# EAGLE design AliDualVar (EAGLE 7.2.0)
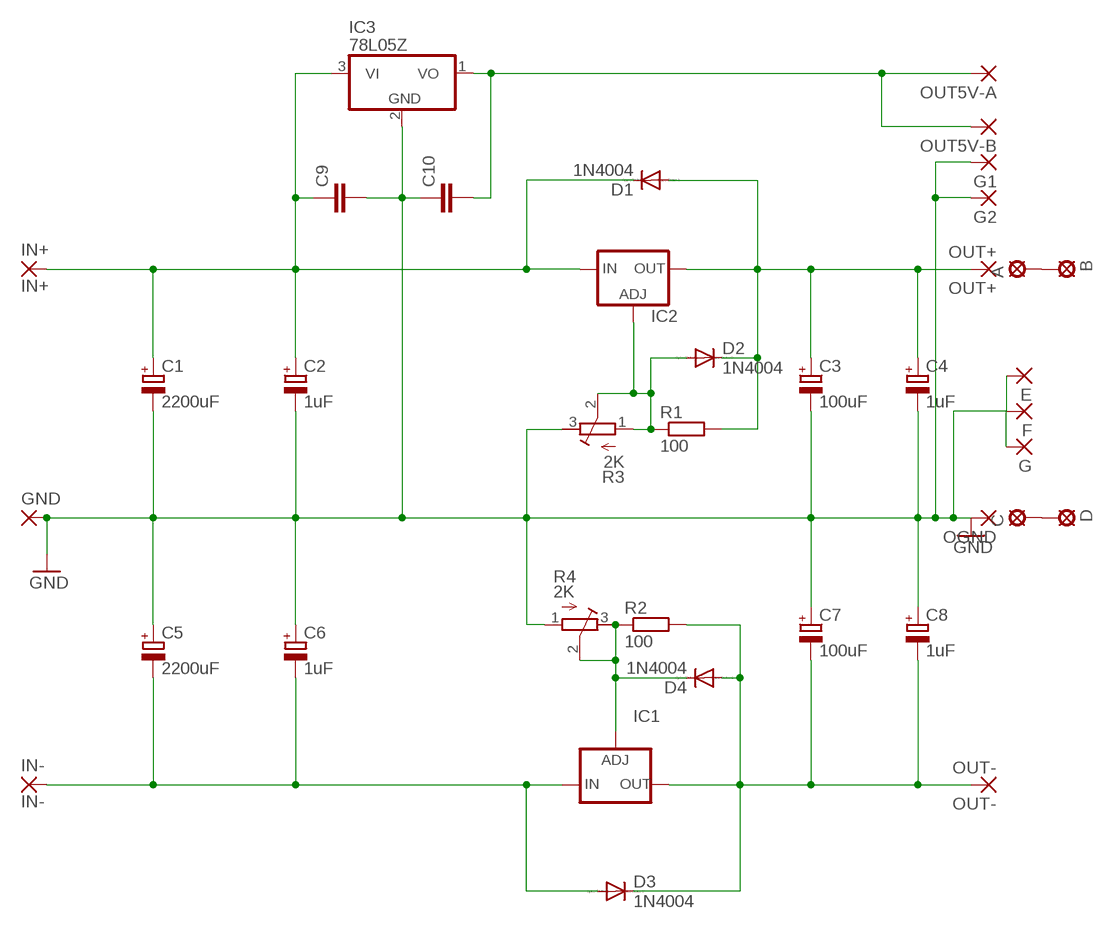
[diagram p0: schematic, sheet 1]

## Parts
A  MCS10B  [MCS10B]
B  MCS10B  [MCS10B]
C  MCS10B  [MCS10B]
C1  2200uF  CPOL-EUE10-35  [EB35D]
C2  1uF  CPOL-EUE5-13  [E5-13]
C3  100uF  CPOL-EUE5-13  [E5-13]
C4  1uF  CPOL-EUE5-13  [E5-13]
C5  2200uF  CPOL-EUE10-35  [EB35D]
C6  1uF  CPOL-EUE5-13  [E5-13]
C7  100uF  CPOL-EUE5-13  [E5-13]
C8  1uF  CPOL-EUE5-13  [E5-13]
C9  C-EU025-024X044  [C025-024X044]
C10  C-EU025-024X044  [C025-024X044]
D  MCS10B  [MCS10B]
D1  1N4004  [DO41-10]
D2  1N4004  [DO41-10]
D3  1N4004  [DO41-10]
D4  1N4004  [DO41-10]
E  3,81/1,4  [3,81/1,4]
F  3,81/1,4  [3,81/1,4]
G  3,81/1,4  [3,81/1,4]
G1  3,81/1,4  [3,81/1,4]
G2  3,81/1,4  [3,81/1,4]
GND  3,81/1,4  [3,81/1,4]
IC1  LM337TL  [337TL]
IC2  LM317TL  [317TL]
IC3  78L05Z  [TO92]
IN+  IN+  3,81/1,4  [3,81/1,4]
IN-  IN-  3,81/1,4  [3,81/1,4]
OGND  3,81/1,4  [3,81/1,4]
OUT5V-A  3,81/1,4  [3,81/1,4]
OUT5V-B  3,81/1,4  [3,81/1,4]
OUT+  OUT+  3,81/1,4  [3,81/1,4]
OUT-  OUT-  3,81/1,4  [3,81/1,4]
R1  100  R-EU_0207/7  [0207/7]
R2  100  R-EU_0207/7  [0207/7]
R3  2K  R-TRIMM3339P  [RTRIM3339P]
R4  2K  R-TRIMM3339P  [RTRIM3339P]

## Nets
GND: C1.- C2.- C3.- C4.- C5.+ C6.+ C7.+ C8.+ C9.2 C10.1 E.1(P) F.1(P) G1.1(P) G2.1(P) G.1(P) GND.1(P) IC3.2(GND) OGND.1(P) R3.3(E) R4.1(A)
N$2: C3.+ C4.+ D1.A D2.C IC2.2(OUT) OUT+.1(P) R1.2
N$3: A.MP B.MP
N$4: C.MP D.MP
N$5: D2.A IC2.1(ADJ) R1.1 R3.1(A) R3.2(S)
N$6: D4.C IC1.1(ADJ) R2.1 R4.2(S) R4.3(E)
N$7: C7.- C8.- D3.C D4.A IC1.3(OUT) OUT-.1(P) R2.2
N$8: C5.- C6.- D3.A IC1.2(IN) IN-.1(P)
N$9: C10.2 IC3.1(VO) OUT5V-A.1(P) OUT5V-B.1(P)
N$12: C1.+ C2.+ C9.1 D1.C IC2.3(IN) IC3.3(VI) IN+.1(P)

## Library data of the parts
A B C D = solpad:MCS10B: SOLDER PAD MC S1, distributor Buerklin, 15F505
C1-C8 = resistor:CPOL-EU: POLARIZED CAPACITOR, European symbol
C9 C10 = rcl:C-EU: CAPACITOR, European symbol
D1-D4 = diode:1N4004: DIODE general purpose rectifier, 1 A
E F G G1 G2 GND IN+ IN- OGND OUT5V-A OUT5V-B OUT+ OUT- = wirepad:3,81/1,4: THROUGH-HOLE PAD
IC1 = v-reg:LM337TL: VOLTAGE REGULATOR
IC2 = v-reg:LM317TL: VOLTAGE REGULATOR
IC3 = linear:78*: Positive VOLTAGE REGULATOR Source: http://cache.national.com/ds/LM/LM78L05.pdf http://www.fairchildsemi.com/ds/LM/LM7805.pdf
R1 R2 = resistor:R-EU_: RESISTOR, European symbol
R3 R4 = resistor:R-TRIMM: Trimm resistor

## Board
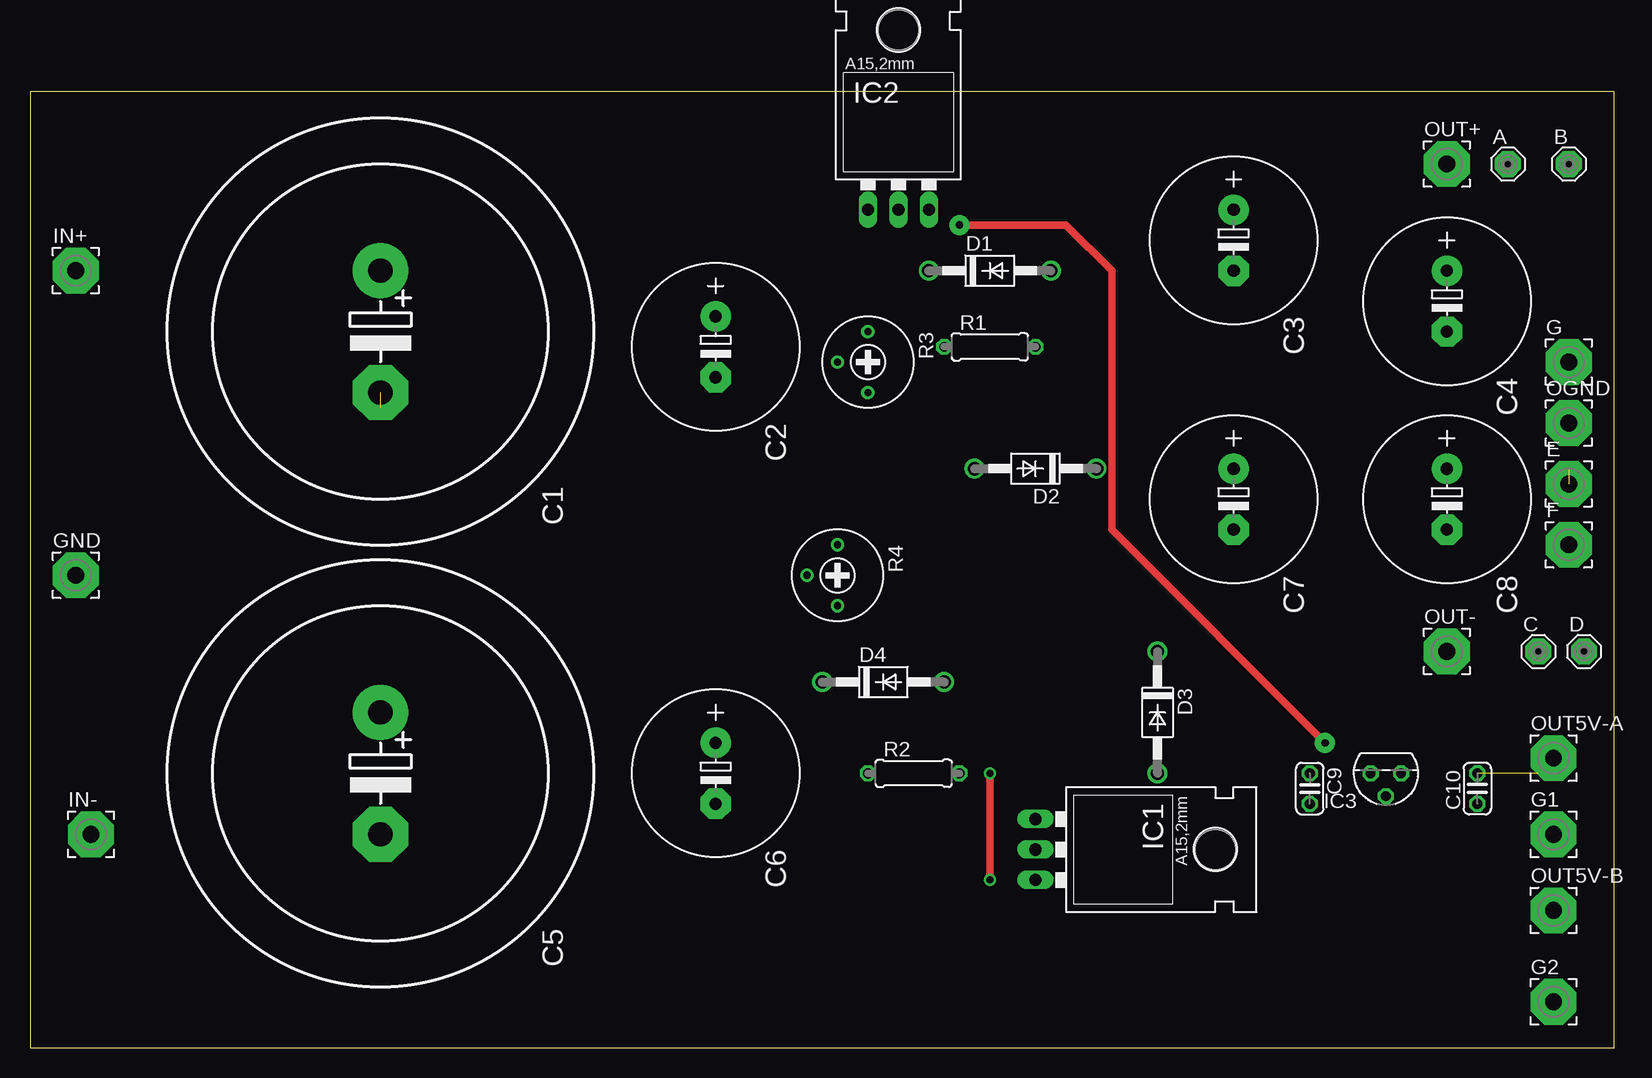
[diagram p1: board, top side]
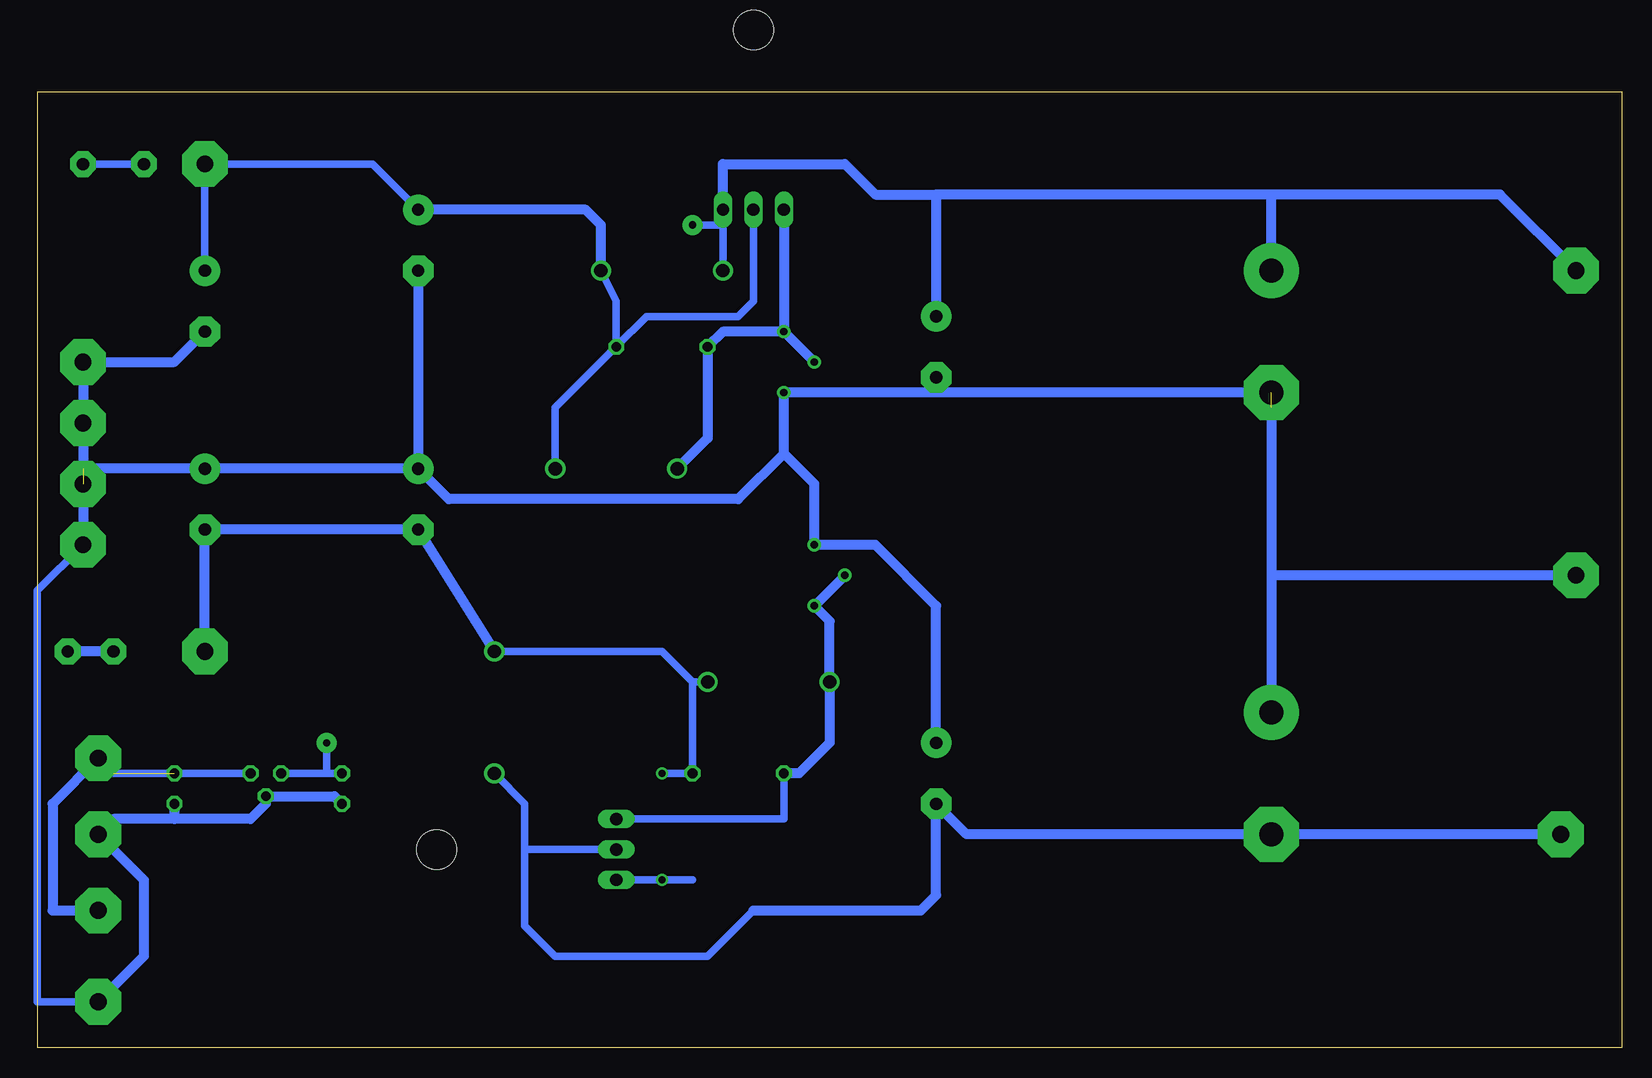
[diagram p2: board, bottom side, seen from below]

Size 132.06 x 79.68 mm. Coordinates in mm from the lower left corner, seen from the top.
Outline: 0,0 132.06,0 132.06,79.68 0,79.68 0,0
Copper layers (1*16): Top 0.035mm / dielectric 1.5mm / Bottom 0.035mm
Design rules "default": minimum track width 10mil, minimum drill 24mil, track to track 8mil, track to pad 8mil, pad to pad 8mil, via to via 8mil, smd to smd 8mil, copper to edge 40mil, drill to drill 8mil, minimum pad ring 10mil, minimum via ring 8mil, stop-mask expansion 4mil, vias tented up to drill 0mil, thermal gap 10mil

### Footprints (pad centres in the part's own frame; a part is rotated, then mirrored left to right if it is on the bottom)
MCS10B = drill 1.016 pad 2.159 octagon: MP 0,0
EB35D = drill 2.007 pad 4.597: + -5.08,0 | drill 2.007 pad 4.597 octagon: - 5.08,0
E5-13 = drill 1.016 pad 2.54: + -2.54,0 | drill 1.016 pad 2.54 octagon: - 2.54,0
C025-024X044 = drill 0.813 octagon: 1 -1.27,0; 2 1.27,0
DO41-10 = drill 1.118: A 5.08,0; C -5.08,0
3,81/1,4 = drill 1.397 pad 3.81 octagon: 1 0,0
337TL = drill 1.016 long: 1 -2.54,-3.81; 2 0,-3.81; 3 2.54,-3.81 | hole 3.302: 0,11.176
317TL = drill 1.016 long: 1 -2.54,-3.81; 2 0,-3.81; 3 2.54,-3.81 | hole 3.302: 0,11.176
TO92 = drill 0.813 octagon: 1 -1.27,0; 2 0,1.905; 3 1.27,0
0207/7 = drill 0.813 octagon: 1 -3.81,0; 2 3.81,0
RTRIM3339P = drill 0.61: 1 -2.54,0; 2 0,-2.54; 3 2.54,0

### Placement (x,y rotation side)
A  123.19,73.66 0 top
B  128.27,73.66 0 top
C  125.73,33.02 0 top
C1  29.21,59.69 270 top
C2  57.15,58.42 270 top
C3  100.33,67.31 270 top
C4  118.11,62.23 270 top
C5  29.21,22.86 270 top
C6  57.15,22.86 270 top
C7  100.33,45.72 270 top
C8  118.11,45.72 270 top
C9  106.68,21.59 270 top
C10  120.65,21.59 90 top
D  129.54,33.02 0 top
D1  80.01,64.77 0 top
D2  83.82,48.26 180 top
D3  93.98,27.94 270 top
D4  71.12,30.48 0 top
E  128.27,46.99 0 top
F  128.27,41.91 0 top
G  128.27,57.15 0 top
G1  127,17.78 0 top
G2  127,3.81 0 top
GND  3.81,39.37 0 top
IC1  87.63,16.51 270 top
IC2  72.39,73.66 0 top
IC3  113.03,22.86 180 top
IN+  3.81,64.77 0 top
IN-  5.08,17.78 0 top
OGND  128.27,52.07 0 top
OUT5V-A  127,24.13 0 top
OUT5V-B  127,11.43 0 top
OUT+  118.11,73.66 0 top
OUT-  118.11,33.02 0 top
R1  80.01,58.42 0 top
R2  73.66,22.86 0 top
R3  69.85,57.15 270 top
R4  67.31,39.37 270 top

### Tracks (layer width: path | path; a pad name or v marks a point on that pad's centre or on a via)
GND  (2 unrouted)
  Bottom 0.61: OGND.1 F.1 132.08,38.1 132.08,3.81 G2.1
  Bottom 0.813: C1.- 29.21,39.37 | 29.21,39.37 C5.+ | GND.1 29.21,39.37 | C6.+ 57.15,36.83 62.23,41.91 R4.1 67.31,46.99 69.85,49.53 | 69.85,49.53 R3.3 57.15,54.61 | 30.48,54.61 57.15,54.61 | C2.- 57.15,54.61 | 69.85,49.53 73.66,45.72 97.79,45.72 C7.+ | C3.- C7.+ | C4.- 120.65,57.15 G.1 OGND.1 128.27,48.26 | 128.27,48.26 F.1 | 128.27,48.26 C8.+ C7.+ | G2.1 123.19,7.62 123.19,13.97 G1.1 125.73,19.05 120.65,19.05 | C9.2 107.31,20.95 IC3.2 113.03,20.32 114.3,19.05 120.65,19.05 | C10.1 120.65,19.05
  Bottom 1.27: 29.21,53.34 27.94,54.61 | C1.- 30.48,54.61
N$2
  Bottom 0.61: IC2.2 72.39,62.23 73.66,60.96 81.28,60.96 R1.2 | D1.A 83.82,62.23 R1.2 | R1.2 88.9,53.34 D2.C | C3.+ 104.14,73.66 OUT+.1 C4.+
  Bottom 0.813: D1.A 85.09,68.58 86.36,69.85 C3.+
N$3
  Bottom 0.61: A.MP B.MP
N$4
  Bottom 0.813: C.MP D.MP
N$5
  Bottom 0.813: IC2.1 R3.1 | R3.1 R3.2 | R3.1 74.93,59.69 R1.1 76.2,50.8 D2.A
N$6
  Bottom 0.61: R2.1 69.85,19.05 IC1.1
  Bottom 0.813: R4.2 R4.3 66.04,35.56 D4.C 66.04,25.4 68.58,22.86 R2.1
N$7  (via drill 0.6 pad 0.3)
  Top 0.61: v80.01,22.86 v80.01,13.97
  Bottom 0.61: IC1.3 v80.01,13.97 77.47,13.97 | 77.47,30.48 R2.2 v80.01,22.86 | 77.47,30.48 D4.A | 77.47,30.48 80.01,33.02 D3.C
  Bottom 0.813: D3.C C7.- C8.- OUT-.1
N$8
  Bottom 0.61: D3.A 91.44,20.32 91.44,16.51 | 91.44,16.51 IC1.2 | 72.39,11.43 76.2,7.62 88.9,7.62 91.44,10.16 91.44,16.51
  Bottom 0.813: IN-.1 C5.- 54.61,17.78 C6.- 57.15,12.7 58.42,11.43 72.39,11.43
N$9  (1 unrouted)
  Bottom 0.61: OUT5V-A.1 125.73,22.86 IC3.1
  Bottom 0.813: OUT5V-A.1 130.81,20.32 130.81,11.43 OUT5V-B.1
N$12  (via drill 0.6 pad 1.68)
  Top 0.61: v107.95,25.4 90.17,43.18 90.17,64.77 86.36,68.58 v77.47,68.58
  Bottom 0.61: D1.C 74.93,68.58 | 74.93,68.58 IC2.3 | v77.47,68.58 74.93,68.58 | IC3.3 107.95,22.86 | 107.95,22.86 C9.1 | 107.95,22.86 v107.95,25.4
  Bottom 0.813: IN+.1 10.16,71.12 29.21,71.12 | 29.21,71.12 57.15,71.12 | 57.15,71.12 C2.+ | C1.+ 29.21,71.12 | IC2.3 74.93,73.66 64.77,73.66 62.23,71.12 57.15,71.12